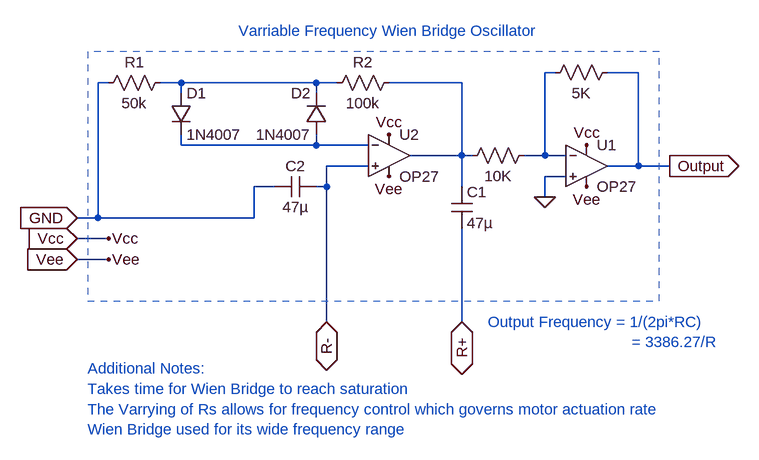
[diagram p0: schematic Wien_Bridge_Oscilator.asc]
Wien_Bridge_Oscilator.asc, the LTspice schematic file:
Version 4
SHEET 1 1460 680
WIRE 480 -32 464 -32
WIRE 608 -32 560 -32
WIRE -208 -16 -224 -16
WIRE -96 -16 -128 -16
WIRE 112 -16 -96 -16
WIRE 144 -16 112 -16
WIRE 336 -16 224 -16
WIRE -96 0 -96 -16
WIRE 112 0 112 -16
WIRE -96 80 -96 64
WIRE 112 80 112 64
WIRE 112 80 -96 80
WIRE 192 80 112 80
WIRE 336 96 336 -16
WIRE 336 96 256 96
WIRE 352 96 336 96
WIRE 464 96 464 -32
WIRE 464 96 432 96
WIRE 496 96 464 96
WIRE 192 112 128 112
WIRE 608 112 608 -32
WIRE 608 112 560 112
WIRE 656 112 608 112
WIRE 496 128 464 128
WIRE 48 144 16 144
WIRE 128 144 128 112
WIRE 128 144 112 144
WIRE 336 144 336 96
WIRE 464 160 464 128
WIRE -224 192 -224 -16
WIRE -224 192 -256 192
WIRE 16 192 16 144
WIRE 16 192 -224 192
WIRE -208 224 -256 224
WIRE -208 256 -256 256
WIRE 128 352 128 144
WIRE 336 352 336 208
FLAG -256 256 Vee
IOPIN -256 256 In
FLAG 224 128 Vee
FLAG 224 64 Vcc
FLAG 656 112 Output
IOPIN 656 112 Out
FLAG -256 192 GND
IOPIN -256 192 In
FLAG -256 224 Vcc
IOPIN -256 224 In
FLAG -208 256 Vee
FLAG -208 224 Vcc
FLAG 128 352 R-
IOPIN 128 352 BiDir
FLAG 336 352 R+
IOPIN 336 352 BiDir
FLAG 464 160 0
FLAG 528 80 Vcc
FLAG 528 144 Vee
SYMBOL Opamps\\OP27 224 32 R0
SYMATTR InstName U2
SYMBOL res -224 0 R270
WINDOW 0 32 56 VTop 2
WINDOW 3 0 56 VBottom 2
SYMATTR InstName R1
SYMATTR Value 50k
SYMBOL res 128 0 R270
WINDOW 0 32 56 VTop 2
WINDOW 3 0 56 VBottom 2
SYMATTR InstName R2
SYMATTR Value 100k
SYMBOL cap 320 144 R0
SYMATTR InstName C1
SYMATTR Value 47µ
SYMBOL cap 112 128 R90
WINDOW 0 0 32 VBottom 2
WINDOW 3 32 32 VTop 2
SYMATTR InstName C2
SYMATTR Value 47µ
SYMBOL diode -112 0 R0
SYMATTR InstName D1
SYMATTR Value 1N4007
SYMBOL diode 128 64 R180
WINDOW 0 24 64 Left 2
WINDOW 3 24 0 Left 2
SYMATTR InstName D2
SYMATTR Value 1N4007
SYMBOL Opamps\\OP27 528 48 R0
SYMATTR InstName U1
SYMBOL res 448 80 R90
WINDOW 0 0 56 Invisible 2
WINDOW 3 32 56 VTop 2
SYMATTR InstName R3
SYMATTR Value 10K
SYMBOL res 576 -48 R90
WINDOW 0 0 56 Invisible 2
WINDOW 3 32 56 VTop 2
SYMATTR InstName R4
SYMATTR Value 5K
TEXT -8 -96 Left 2 ;Varriable Frequency Wien Bridge Oscillator
TEXT -240 424 Left 2 ;Additional Notes:\nTakes time for Wien Bridge to reach saturation\nThe Varrying of Rs allows for frequency control which governs motor actuation rate\nWien Bridge used for its wide frequency range
TEXT 376 352 Left 2 ;Output Frequency = 1/(2pi*RC)\n                                = 3386.27/R
RECTANGLE Normal -240 320 640 -64 2

The netlist it stands for:
* Wien_Bridge_Oscilator.asc
XU2 R- N004 Vcc Vee N003 OP27  ; pins In+ In- V+ V- OUT
R1 GND N002 50k
R2 N002 N003 100k
C1 N003 R+ 47µ
C2 R- GND 47µ
D1 N002 N004 1N4007
D2 N004 N002 1N4007
XU1 0 N001 Vcc Vee Output OP27  ; pins In+ In- V+ V- OUT
R3 N001 N003 10K
R4 Output N001 5K
.model D D
.lib standard.dio
* Varriable Frequency Wien Bridge Oscillator
* Additional Notes:
* Takes time for Wien Bridge to reach saturation
* The Varrying of Rs allows for frequency control which governs motor actuation rate
* Wien Bridge used for its wide frequency range
* Output Frequency = 1/(2pi*RC)
*                                 = 3386.27/R
.lib ADI.lib
.backanno
.end